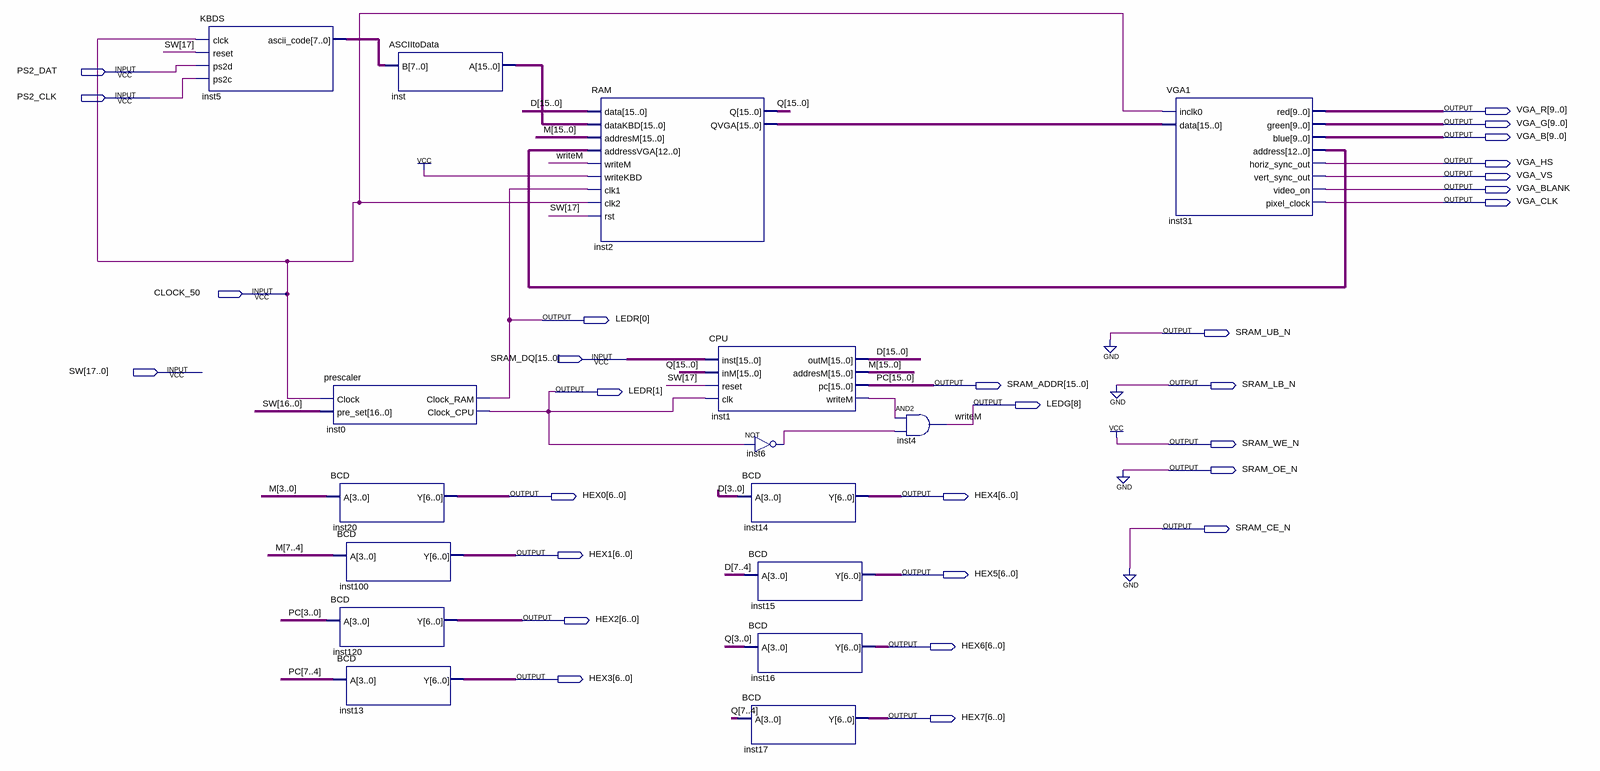
[diagram p0: schematic sheet]
// Quartus schematic RamTest.bdf as structural Verilog: 16 symbols, 29 pins
module RamTest (
  input  PS2_DAT,
  input  PS2_CLK,
  input  CLOCK_50,
  input  [15:0] SRAM_DQ,
  input  [17:0] SW,
  output [9:0] VGA_R,
  output [9:0] VGA_G,
  output [9:0] VGA_B,
  output VGA_HS,
  output VGA_VS,
  output VGA_BLANK,
  output VGA_CLK,
  output [1:0] LEDR,
  output SRAM_UB_N,
  output [15:0] SRAM_ADDR,
  output SRAM_LB_N,
  output [8:8] LEDG,
  output SRAM_WE_N,
  output SRAM_OE_N,
  output [6:0] HEX0,
  output [6:0] HEX4,
  output SRAM_CE_N,
  output [6:0] HEX1,
  output [6:0] HEX5,
  output [6:0] HEX2,
  output [6:0] HEX6,
  output [6:0] HEX3,
  output [6:0] HEX7
);

  wire inst1_writem, inst6_out;
  wire [7:0] inst5_ascii_code;
  wire [12:0] inst31_address;
  wire [15:0] D, inst2_qvga, inst_a, M, Q;

  KBDS inst5 (.clck(CLOCK_50), .reset(SW[17]), .ps2d(PS2_DAT), .ps2c(PS2_CLK), .ascii_code(inst5_ascii_code));
  prescaler inst0 (.Clock(CLOCK_50), .pre_set(SW[16:0]), .Clock_RAM(LEDR[0]), .Clock_CPU(LEDR[1]));
  BCD inst20 (.A(M[3:0]), .Y(HEX0));
  BCD inst100 (.A(M[7:4]), .Y(HEX1));
  BCD inst120 (.A(SRAM_ADDR[3:0]), .Y(HEX2));
  BCD inst13 (.A(SRAM_ADDR[7:4]), .Y(HEX3));
  ASCIItoData inst (.B(inst5_ascii_code), .A(inst_a));
  RAM inst2 (
    .data(D), .dataKBD(inst_a), .addresM(M), .addressVGA(inst31_address), .writeM(LEDG[8]), .writeKBD(1'b1),
    .clk1(LEDR[0]), .clk2(CLOCK_50), .rst(SW[17]), .Q(Q), .QVGA(inst2_qvga));
  CPU inst1 (
    .inst(SRAM_DQ), .inM(Q), .reset(SW[17]), .clk(LEDR[1]), .outM(D), .addresM(M), .pc(SRAM_ADDR),
    .writeM(inst1_writem));
  not inst6 (inst6_out, LEDR[1]);
  BCD inst14 (.A(D[3:0]), .Y(HEX4));
  BCD inst15 (.A(D[7:4]), .Y(HEX5));
  BCD inst16 (.A(Q[3:0]), .Y(HEX6));
  BCD inst17 (.A(Q[7:4]), .Y(HEX7));
  and inst4 (LEDG[8], inst1_writem, inst6_out);
  VGA1 inst31 (
    .inclk0(CLOCK_50), .data(inst2_qvga), .red(VGA_R), .green(VGA_G), .blue(VGA_B), .address(inst31_address),
    .horiz_sync_out(VGA_HS), .vert_sync_out(VGA_VS), .video_on(VGA_BLANK), .pixel_clock(VGA_CLK));

  assign SRAM_CE_N = 1'b0;
  assign SRAM_LB_N = 1'b0;
  assign SRAM_OE_N = 1'b0;
  assign SRAM_UB_N = 1'b0;
  assign SRAM_WE_N = 1'b1;

  // Other names for the same wires on the sheet: writeM = LEDG[8]; PC[15:0] = SRAM_ADDR
endmodule
